# EAGLE schematic CADET_DUMMY_SCHEMATIC_v2 (EAGLE 9.7.0)
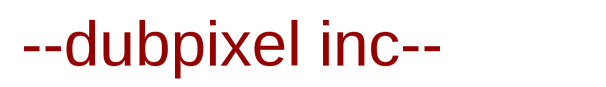
[diagram p0: schematic, sheet 1]

## Parts
U$1  DPX_LOGOCP  [DPX_LOGO_MED(.8)_CU]

## Library data of the parts
U$1 = dpx-graphics:DPX_LOGO